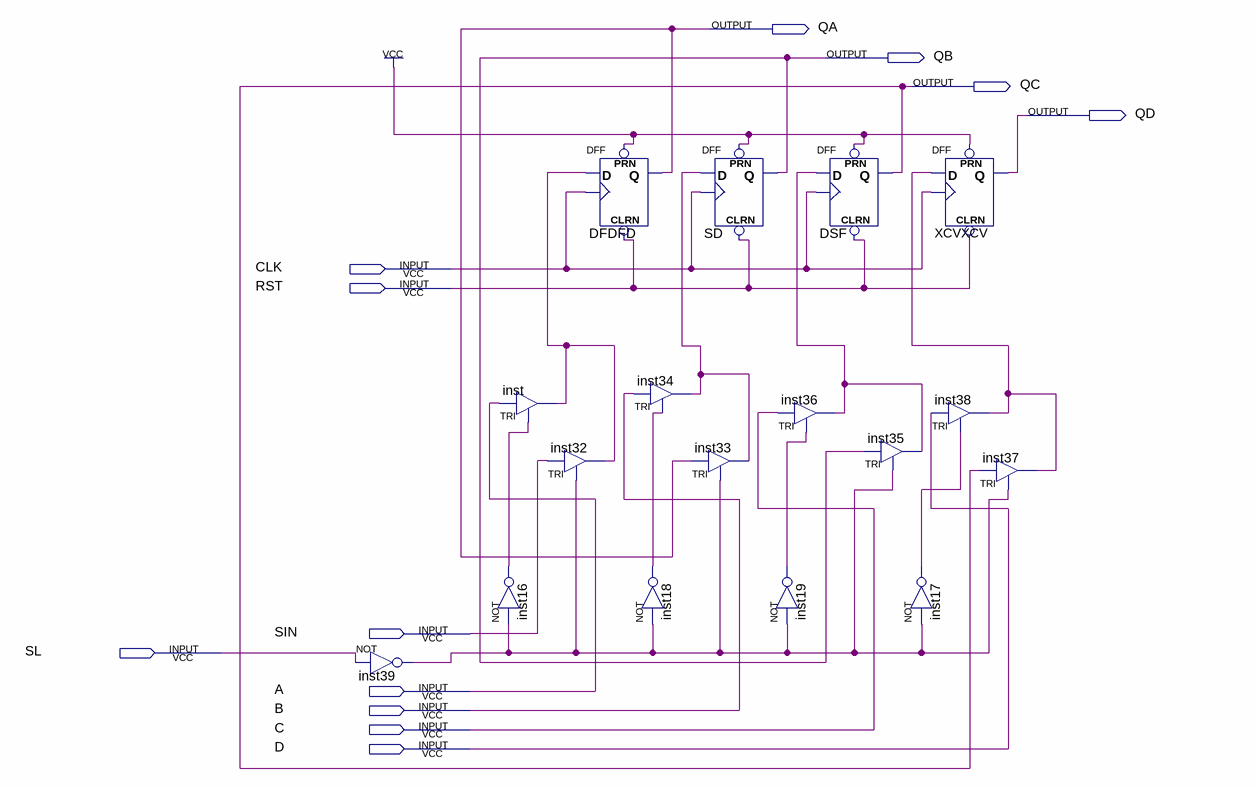
[diagram p0: schematic sheet]
// Quartus schematic ex8.bdf as structural Verilog: 17 symbols, 12 pins
module ex8 (
  input  CLK,
  input  RST,
  input  SIN,
  input  SL,
  input  A,
  input  B,
  input  C,
  input  D,
  output QA,
  output QB,
  output QC,
  output QD
);

  wire inst16_out, inst17_out, inst18_out, inst19_out, inst34_out, inst36_out, inst38_out, inst39_out,
       inst_out;

  not inst39 (inst39_out, SL);
  TRI inst (.IN(A), .OE(inst16_out), .OUT(inst_out));
  TRI inst32 (.IN(SIN), .OE(inst39_out), .OUT(inst_out));
  not inst16 (inst16_out, inst39_out);
  DFF DFDFD (.CLRN(RST), .CLK(CLK), .D(inst_out), .PRN(1'b1), .Q(QA));
  DFF SD (.CLRN(RST), .CLK(CLK), .D(inst34_out), .PRN(1'b1), .Q(QB));
  TRI inst34 (.IN(B), .OE(inst18_out), .OUT(inst34_out));
  TRI inst33 (.IN(QA), .OE(inst39_out), .OUT(inst34_out));
  not inst18 (inst18_out, inst39_out);
  TRI inst36 (.IN(C), .OE(inst19_out), .OUT(inst36_out));
  not inst19 (inst19_out, inst39_out);
  DFF DSF (.CLRN(RST), .CLK(CLK), .D(inst36_out), .PRN(1'b1), .Q(QC));
  DFF XCVXCV (.CLRN(RST), .CLK(CLK), .D(inst38_out), .PRN(1'b1), .Q(QD));
  TRI inst38 (.IN(D), .OE(inst17_out), .OUT(inst38_out));
  TRI inst35 (.IN(QB), .OE(inst39_out), .OUT(inst36_out));
  not inst17 (inst17_out, inst39_out);
  TRI inst37 (.IN(QC), .OE(inst39_out), .OUT(inst38_out));
endmodule
